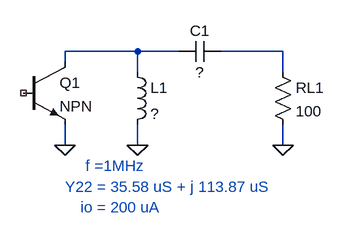
[diagram p0: schematic eje2_sch.asc]
eje2_sch.asc, the LTspice schematic file:
Version 4
SHEET 1 880 680
WIRE -64 64 -176 64
WIRE 0 64 -64 64
WIRE 160 64 64 64
WIRE -176 80 -176 64
WIRE -64 96 -64 64
WIRE 160 96 160 64
WIRE -176 208 -176 176
WIRE -64 208 -64 176
WIRE 160 208 160 176
FLAG -176 208 0
FLAG -64 208 0
FLAG 160 208 0
SYMBOL ind -80 80 R0
SYMATTR InstName L1
SYMATTR Value ?
SYMBOL cap 0 80 R270
WINDOW 0 32 32 VTop 2
WINDOW 3 0 32 VBottom 2
SYMATTR InstName C1
SYMATTR Value ?
SYMBOL res 144 80 R0
SYMATTR InstName RL1
SYMATTR Value 100
SYMBOL npn -240 80 R0
SYMATTR InstName Q1
TEXT -144 240 Left 2 ;f =1MHz
TEXT -176 272 Left 2 ;Y22 = 35.58 uS + j 113.87 uS
TEXT -152 304 Left 2 ;io = 200 uA

The netlist it stands for:
* eje2_sch.asc
L1 N001 0 ?
C1 N001 N002 ?
RL1 N002 0 100
Q1 N001 NC_01 0 0 NPN
.model NPN NPN
.model PNP PNP
.lib standard.bjt
* f =1MHz
* Y22 = 35.58 uS + j 113.87 uS
* io = 200 uA
.backanno
.end